# Altium schematic sheet yard-ice-toplevel.SchDoc: Yard-Ice-Top
size 365 x 274 mm; Revision: 1.0; SheetNumber: 1; SheetTotal: 5
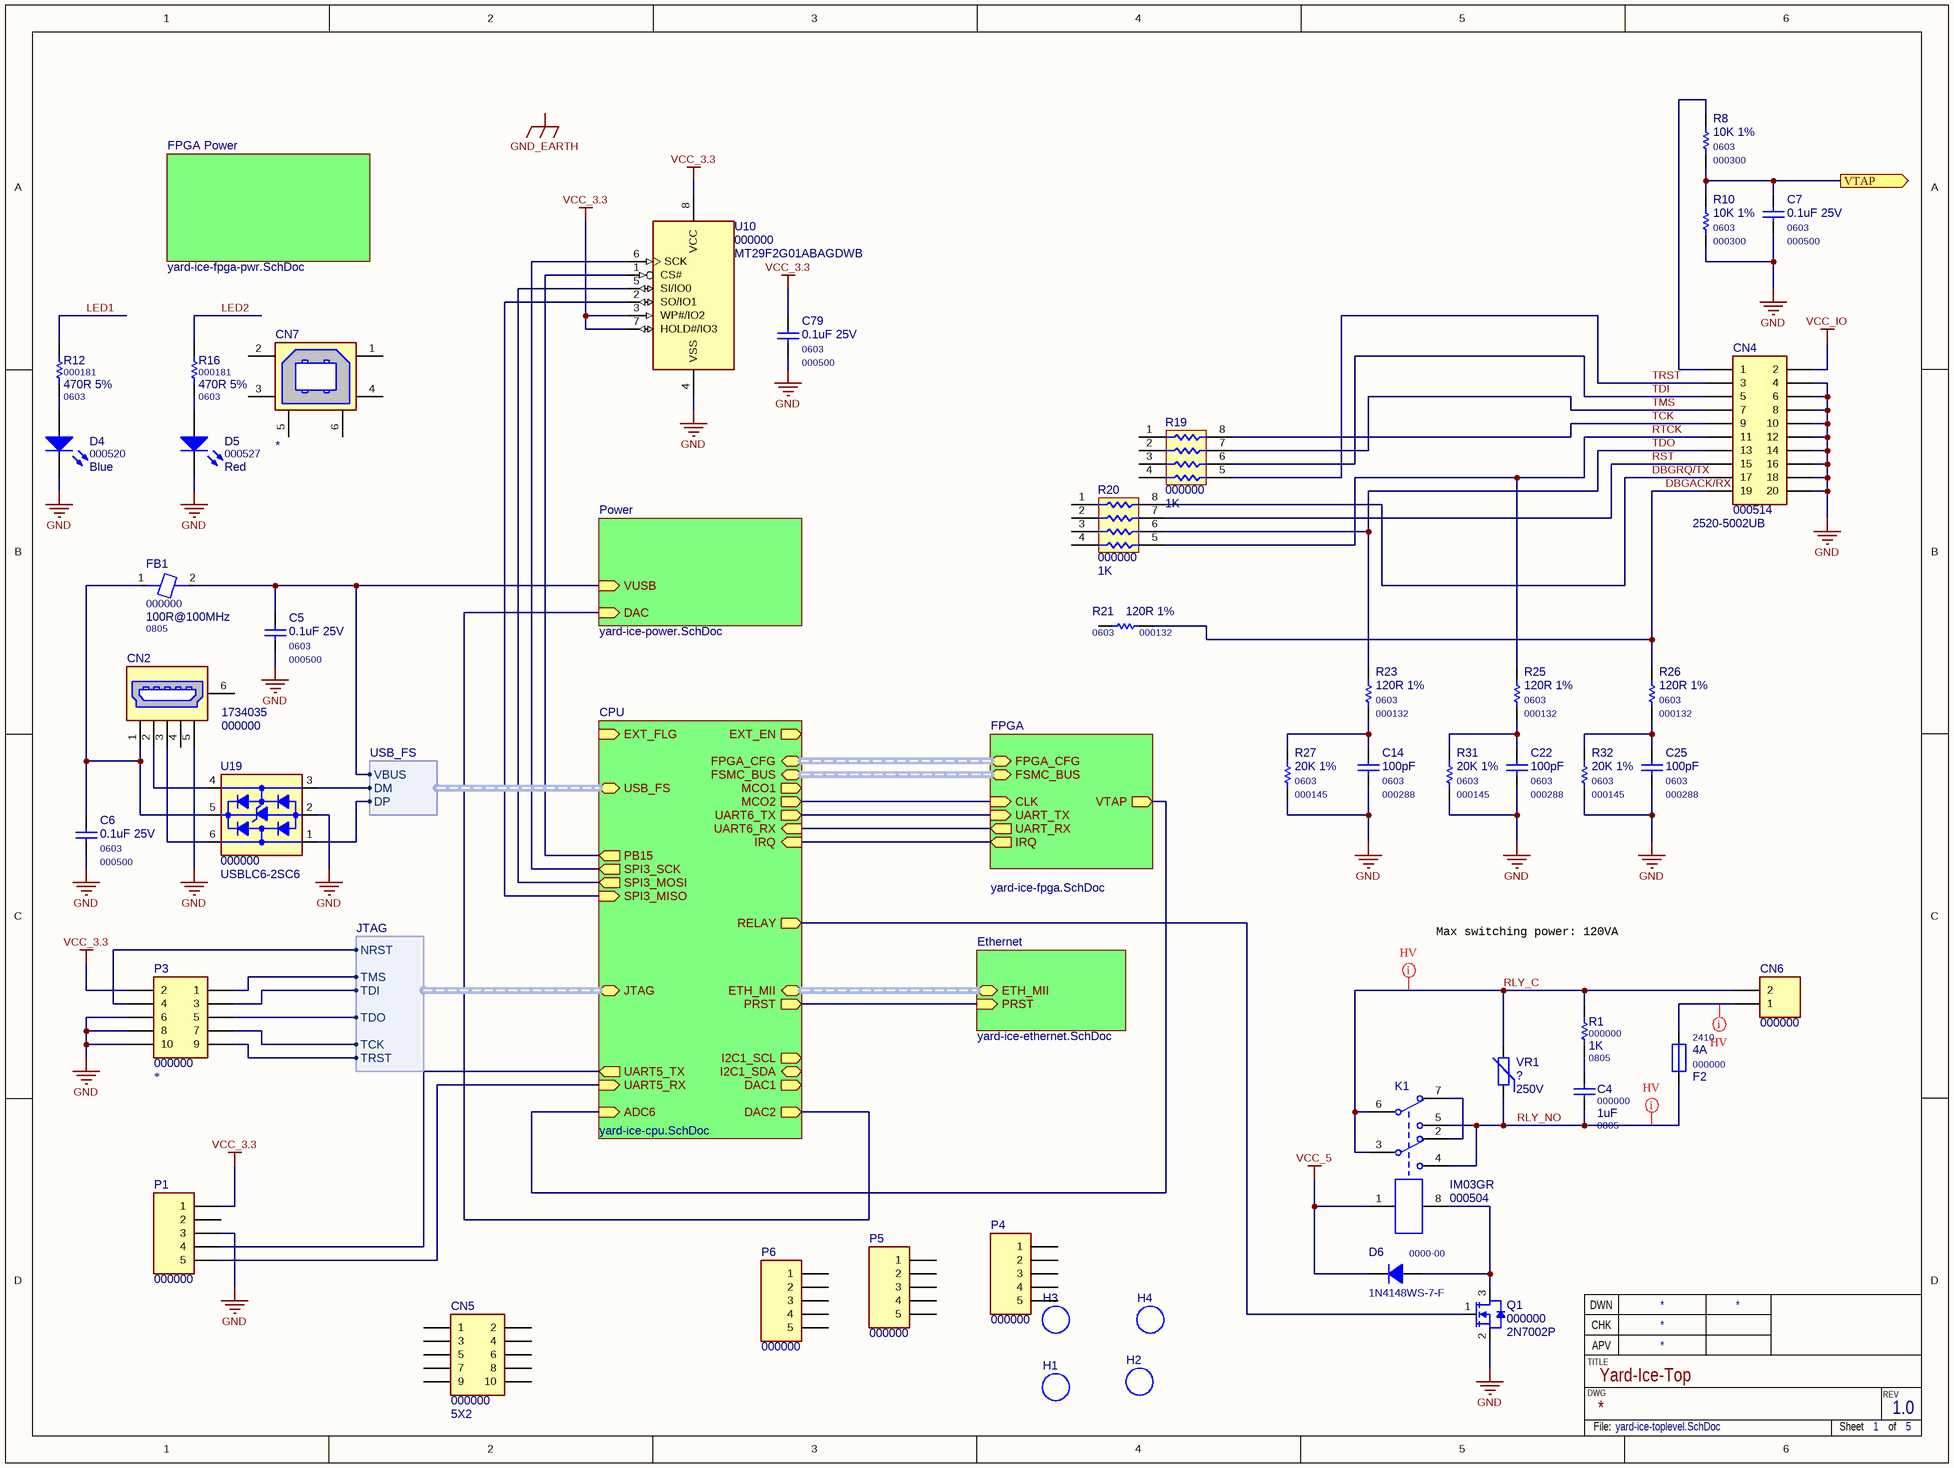
[diagram p0: yard-ice-toplevel.SchDoc]

## Parts
C4  000000  value 1uF  Package: 0805  [C0805HV]
C5  000500  value 0.1uF 25V  Package: 0603  [C0603M]
C6  000500  value 0.1uF 25V  Package: 0603  [C0603M]
C7  000500  value 0.1uF 25V  Package: 0603  [C0603M]
C14  000288  value 100pF  Package: 0603  [C0603M]
C22  000288  value 100pF  Package: 0603  [C0603M]
C25  000288  value 100pF  Package: 0603  [C0603M]
C79  000500  value 0.1uF 25V  Package: 0603  [C0603M]
CN2  value 1734035  [1734035]  (hidden comment: 000000)
CN4  000514  value 2520-5002UB  [TST-110-04-G-D-RA]
CN5  000000  value 5X2  [TST-105-04-G-D-RA]
CN6  000000  [691322110002]
CN7  *  [4-1734376]
D4  000520  value Blue  [LED0805L LP]
D5  000527  value Red  [LED0805L LP]
D6  0000-00  MF PN: 1N4148WS-7-F  [SOD-323-M]
F2  000000  value 4A  Package: 2410  [F2410]
FB1  000000  value 100R@100MHz  Package: 0805  [L0805M]
H1  Hole Non Plated  [Hole NP 3.2x5.0x5.0]  (value not drawn)
H2  Hole Non Plated  [Hole NP 3.2x5.0x5.0]  (value not drawn)
H3  Hole Non Plated  [Hole NP 3.2x5.0x5.0]  (value not drawn)
H4  Hole Non Plated  [Hole NP 3.2x5.0x5.0]  (value not drawn)
K1  000504  value IM03GR  [Relay-10X6]
P1  000000  [TSW-105-07-G-S]
P3  000000  [TSW-105-07-G-D]
P4  000000  [TSW-105-07-G-S]
P5  000000  [TSW-105-07-G-S]
P6  000000  [TSW-105-07-G-S]
Q1  000000  value 2N7002P  [SOT-23-M]
R1  000000  value 1K  Package: 0805  [R0805HV]
R8  000300  value 10K 1%  Package: 0603  [R0603M]
R10  000300  value 10K 1%  Package: 0603  [R0603M]
R12  000181  value 470R 5%  Package: 0603  [R0603M]
R16  000181  value 470R 5%  Package: 0603  [R0603M]
R19  000000  value 1K  [R0603x4L]
R20  000000  value 1K  [R0603x4L]
R21  000132  value 120R 1%  Package: 0603  [R0603M]
R23  000132  value 120R 1%  Package: 0603  [R0603M]
R25  000132  value 120R 1%  Package: 0603  [R0603M]
R26  000132  value 120R 1%  Package: 0603  [R0603M]
R27  000145  value 20K 1%  Package: 0603  [R0603M]
R31  000145  value 20K 1%  Package: 0603  [R0603M]
R32  000145  value 20K 1%  Package: 0603  [R0603M]
U10  000000  value MT29F2G01ABAGDWB  [U-PDFN-8]
U19  000000  value USBLC6-2SC6  [SOT23-6L]
VR1  ?  value 250V  [MOV7x4.8-5.0]

## Sub-sheets
CPU = yard-ice-cpu.SchDoc: ETH_MII (harness ETH_MII), FSMC_BUS (harness FSMC_BUS), FPGA_CFG (harness FPGA_CFG), PRST (out), MCO2 (out), USB_FS (harness USB_FS), JTAG (harness JTAG), EXT_EN (out), EXT_FLG (in), ADC6 (in), DAC2 (out), I2C1_SDA (bidir), I2C1_SCL (out), UART6_TX (out), UART6_RX (in), UART5_TX (out), UART5_RX (in), RELAY (out), IRQ (in), DAC1 (out), SPI3_MISO (in), SPI3_MOSI (out), SPI3_SCK (out), PB15 (out), MCO1 (out)
Ethernet = yard-ice-ethernet.SchDoc: ETH_MII (harness ETH_MII), PRST (in)
FPGA = yard-ice-fpga.SchDoc: FSMC_BUS (harness FSMC_BUS), FPGA_CFG (harness FPGA_CFG), CLK (in), VTAP (out), UART_TX (in), UART_RX (out), IRQ (out)
FPGA Power = yard-ice-fpga-pwr.SchDoc: no entries
Power = yard-ice-power.SchDoc: VUSB (in), DAC (in)

## Ports
VTAP (out)

## Harnesses
USB_FS: VBUS, DM, DP
JTAG: TDO, TDI, TCK, TMS, TRST, NRST

## Nets
GND: C5.2 C6.2 C7.2 C14.2 C22.2 C25.2 C79.2 CN2.5(SHIELD) CN4.4 CN4.6 CN4.8 CN4.10 CN4.12 CN4.14 CN4.16 CN4.18 CN4.20 D4.2(K) D5.2(K) P1.3 P3.6 P3.8 P3.10 Q1.2(S) R10.2 R27.2 R31.2 R32.2 U10.4(VSS) U19.2(GND)
VCC_3.3: C79.1 P1.1 P3.2 U10.3(WP#/IO2) U10.7(HOLD#/IO3) U10.8(VCC)
VCC_5: D6.2(K) K1.1
VCC_IO: CN4.2
DBGACK/RX: CN4.19 R21.1 R26.1
DBGRQ/TX: CN4.17 R20.8
LED1: R12.1
LED2: R16.1
RLY_C: CN6.2 K1.3 K1.6 R1.2 VR1.2
RLY_NO: C4.2 F2.1 K1.4 K1.5 VR1.1
RST: CN4.15 R20.7
RTCK: CN4.11 R20.5 R25.1
TCK: CN4.9 R19.8
TDI: CN4.5 R19.6
TDO: CN4.13 R20.6 R23.1
TMS: CN4.7 R19.7
TRST: CN4.3 R19.5
VTAP: C7.1 R8.2 R10.1 ; port VTAP
NetC4_1: C4.1 R1.1
NetC5_1: C5.1 FB1.2 ; sheet Power/VUSB, sheet CPU/USB_FS.VBUS
NetC6_1: C6.1 CN2.1 FB1.1 U19.5(VBUS)
NetC14_1: C14.1 R23.2 R27.1
NetC22_1: C22.1 R25.2 R31.1
NetC25_1: C25.1 R26.2 R32.1
NetCN2_2: CN2.2 U19.4(I/O2)
NetCN2_3: CN2.3 U19.6(I/O1)
NetCN4_1: CN4.1 R8.1
NetCN6_1: CN6.1 F2.2
NetD4_1: D4.1(A) R12.2
NetD5_1: D5.1(A) R16.2
NetD6_1: D6.1(A) K1.8 Q1.3(D)
NetK1_2: K1.2 K1.7
NetP1_4: P1.4 ; sheet CPU/UART5_TX
NetP1_5: P1.5 ; sheet CPU/UART5_RX
NetP3_1: P3.1 ; sheet CPU/JTAG.TMS
NetP3_3: P3.3 ; sheet CPU/JTAG.TDI
NetP3_4: P3.4 ; sheet CPU/JTAG.NRST
NetP3_5: P3.5 ; sheet CPU/JTAG.TDO
NetP3_7: P3.7 ; sheet CPU/JTAG.TCK
NetP3_9: P3.9 ; sheet CPU/JTAG.TRST
NetQ1_1: Q1.1(G) ; sheet CPU/RELAY
NetU10_1: U10.1(CS#) ; sheet CPU/PB15
NetU10_2: U10.2(SO/IO1) ; sheet CPU/SPI3_MISO
NetU10_5: U10.5(SI/IO0) ; sheet CPU/SPI3_MOSI
NetU10_6: U10.6(SCK) ; sheet CPU/SPI3_SCK
NetU19_1: U19.1(IO/1) ; sheet CPU/USB_FS.DP
NetU19_3: U19.3(IO/2) ; sheet CPU/USB_FS.DM
(unnamed): sheet Power/DAC, sheet CPU/DAC2
(unnamed): sheet CPU/PRST, sheet Ethernet/PRST
(unnamed): sheet CPU/MCO2, sheet FPGA/CLK
(unnamed): sheet CPU/ADC6, sheet FPGA/VTAP
(unnamed): sheet CPU/UART6_TX, sheet FPGA/UART_TX
(unnamed): sheet CPU/UART6_RX, sheet FPGA/UART_RX
(unnamed): sheet CPU/IRQ, sheet FPGA/IRQ

Not connected (* = marked no-connect by the designer): CN2 4 6(SHIELD); CN5 1 2 3 4 5 6 7 8 9 10; CN7 1 2 3 4 5(SHIELD) 6(SHIELD); P1 2; P4 1 2 3 4 5; P5 1 2 3 4 5; P6 1 2 3 4 5; R19 1 2 3 4; R20 1 2 3 4; R21 2

## Buses and harness runs
harness sheet CPU/ETH_MII = sheet Ethernet/ETH_MII
harness sheet CPU/FPGA_CFG = sheet FPGA/FPGA_CFG
harness sheet CPU/FSMC_BUS = sheet FPGA/FSMC_BUS

## Layout directives
net class HV: NetCN6_1, RLY_C, RLY_NO

## Notes on the sheet
- Max switching power: 120VA
- Labels drawn without touching a wire or pin: GND_EARTH
- TITLE
- CHK
- DWN
- APV
- DWG
- REV
- File:
- Sheet
- of

## Library data of the parts
C4 = C0805: SMD Ceramic Chip Capacitor - 0805; PN: 000000; ExtraInfo: *
C5-C7 C79 = C0603: SMD Ceramic Chip Capacitor - 0603 - X7R; MF PN: C1608X7R1E104K; MF: TDK; PN: 000500
C14 C22 C25 = C0603: SMD Ceramic Chip Capacitor - 0603; PN: 000288
CN2 = 1734035: USB Type B Mini - Right Angle - SMD; MF: Tyco; MF PN: 1734035-3; Package: SMT; PN: 000000; Digi-Key PN: A121553CT-ND; Price: 1.16131; Status: Stock
CN4 = Header 10X2: Shrouded Header, 20 Pos, Right Angle; MF: 3M; PN: 000514; Package: PTH; MF PN: 2520-5002UB
CN5 = Header 5X2: Socket 5-Pin, Dual row; MF: Samtec; PN: 000000; Package: SMD; ExtraInfo: *
CN6 = Term Blk 2: Terminal Block, Header, 2-Pos; PN: 000000; Package: PTH; Value: *; ExtraInfo: *
CN7 = 4-1734376: USB Type B - Right Angle - Thru Hole; PN: *; Value: *; Package: *; ExtraInfo: *
D4 D5 = LED0805LP: LED SMD 0805; Package: 0805
  D4: PN: 000520
  D5: PN: 000527
D6 = 1N4148WS: Fast Switching Diode 100V 150mA; MF: Diodes Inc; PN: 0000-00; Package: SOD-323; ExtraInfo: *
F2 = F2410: PN: 000000; ExtraInfo: *; MF: *; MF PN: *
FB1 = FB0805: SMD Chip Ferrite Bead - 0805; PN: 000000; ExtraInfo: *; MF: *; MF PN: *
K1 = Relay-DPDT: Dual-Pole Dual-Throw Relay; MF: Tyco; PN: 000504; Package: SMT; MF PN: IM03GR
P1 P4-P6 = Header 5: Header, 5-Pin; Value: 5x1; PN: 000000; Package: PTH
P3 = Header 5X2: Socket 5-Pin, Dual row; PN: 000000; Package: SMD; Value: *; ExtraInfo: *
Q1 = 2N7002P: N-Channel MOSFET 60V 360mA SOT-23; PN: 000000; Package: SOT-23; ExtraInfo: *
R1 = R0805: SMD Chip Resistor - 0805; PN: 000000; ExtraInfo: *
R8 R10 R12 R16 R21 R23 R25-R27 R31 R32 = R0603: SMD Chip Resistor - 0603
  R8 R10: PN: 000300
  R12 R16: PN: 000181
  R21 R23 R25 R26: PN: 000132
  R27 R31 R32: PN: 000145
R19 R20 = R0603x4: SMD Chip Resistor Array - 4x0603; PackageReference: 4x0402; PN: 000000; ExtraInfo: *; Package: 0603
U10 = MT29F2G01ABAGDWB: 2Gb NANDl Flash Memory,  133MHz, SPI; MF: Micron; MF PN: MT29F2G01ABAGDWB-IT:G TR; PN: 000000; Package: 8VDFN; ExtraInfo: *; Digi-Key PN: 557-1664-1-ND; Price: 3.52500
U19 = USBLC6-2SC6: USB ESD Protection; PN: 0000-00; MF: STMicroelectronics; Package: ST23-6L; ExtraInfo: *; Digi-Key PN: 497-5235-1-ND; MF PN: USBLC6-2SC6; Price: 0.14025; Status: Stock
VR1 = Varistor: Varistor (Voltage-Sensitive Resistor); PN: ?; MF PN: *; Package: PTH; ExtraInfo: *; MF: *; Price: *; Digi-Key PN: *